# Altium schematic sheet obc-v2_RTC-WDOG.SchDoc
size 420 x 297 mm; SheetNumber: 7; SheetTotal: 23
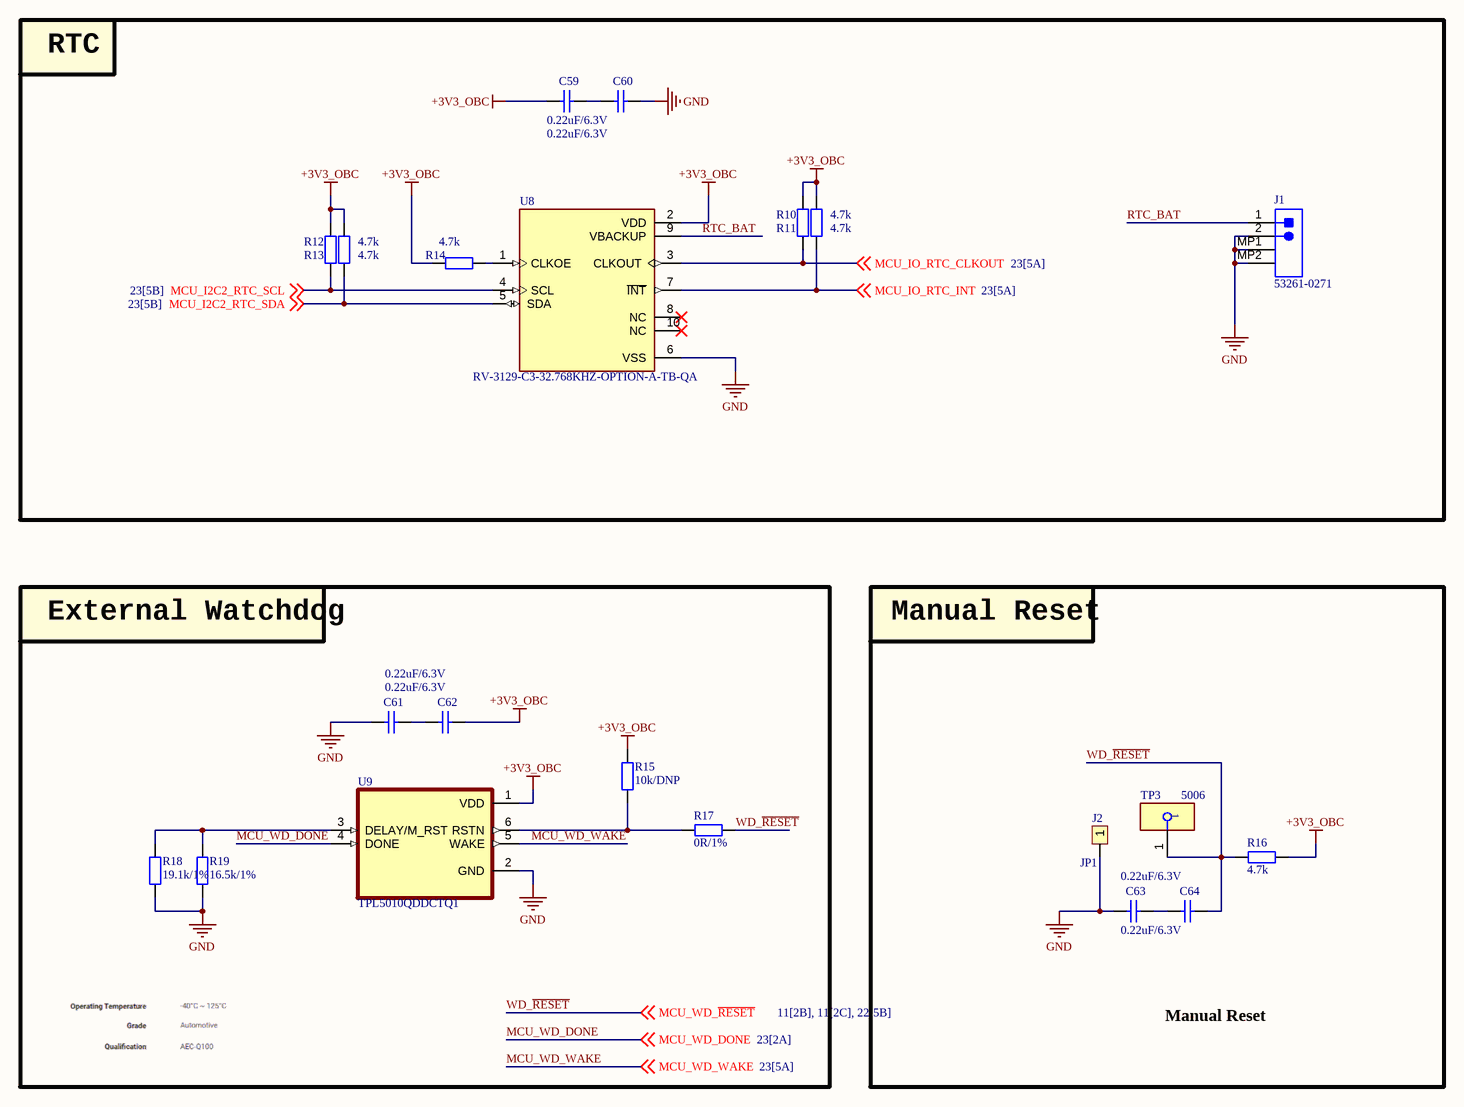
[diagram p0: obc-v2_RTC-WDOG.SchDoc]

## Parts
C59  0.22uF/6.3V  [CAP_C_1005X60]
C60  0.22uF/6.3V  [CAP_C_1005X60]
C61  0.22uF/6.3V  [CAP_C_1005X60]
C62  0.22uF/6.3V  [CAP_C_1005X60]
C63  0.22uF/6.3V  [CAP_C_1005X60]
C64  0.22uF/6.3V  [CAP_C_1005X60]
J1  53261-0271  [MOLX-53261-0271_V]
J2  JP1  [JP1-D1T]
R10  4.7k  [RES_C_1608X60]
R11  4.7k  [RES_C_1608X60]
R12  4.7k  [RES_C_1608X60]
R13  4.7k  [RES_C_1608X60]
R14  4.7k  [RES_C_1608X60]
R15  10k/DNP  [RES_C_1608X60]
R16  4.7k  [RES_C_1608X60]
R17  0R/1%  [RES_C_1608X60]
R18  19.1k/1%  [RES_C_1608X60]
R19  16.5k/1%  [RES_C_1608X60]
TP3  5006  [FP-5006-MFG]
U8  RV-3129-C3-32.768KHZ-OPTION-A-TB-QA  [IC_RV-3129-C3_32.768KHZ_OPTION_A_TB_QA]
U9  TPL5010QDDCTQ1  [SOT95P280X110-6N]

## Blocks framed on the sheet
RTC: C59 C60 J1 R10-R14 U8
External Watchdog: C61 C62 R15 R17-R19 U9
Manual Reset: C63 C64 J2 R16 TP3

## Nets
+3V3_OBC: C59.2 C62.1 R10.2 R11.2 R12.2 R13.2 R14.2 R15.2 R16.2 U8.2(VDD) U9.1(VDD)
GND: C60.1 C61.2 C63.2 J1.2 J1.MP1 J1.MP2 J2.1 R18.1 R19.1 U8.6(VSS) U9.2(GND)
MCU_I2C2_RTC_SCL: R13.1 U8.4(SCL) ; off-sheet MCU_I2C2_RTC_SCL
MCU_I2C2_RTC_SDA: R12.1 U8.5(SDA) ; off-sheet MCU_I2C2_RTC_SDA
MCU_IO_RTC_CLKOUT: R11.1 U8.3(CLKOUT) ; off-sheet MCU_IO_RTC_CLKOUT
MCU_IO_RTC_INT: R10.1 U8.7(~{INT}) ; off-sheet MCU_IO_RTC_INT
MCU_WD_DONE: U9.4(DONE) ; off-sheet MCU_WD_DONE
MCU_WD_WAKE: U9.5(WAKE) ; off-sheet MCU_WD_WAKE
RTC_BAT: J1.1 U8.9(VBACKUP)
WD_~{RESET}: C64.1 R16.1 R17.1 TP3.1 ; off-sheet MCU_WD_~{RESET}  [also labelled MCU_WD_~{RESET}]
NetC59_1: C59.1 C60.2
NetC61_1: C61.1 C62.2
NetC63_1: C63.1 C64.2
NetR14_1: R14.1 U8.1(CLKOE)
NetR15_1: R15.1 R17.2 U9.6(RSTN)
NetR18_2: R18.2 R19.2 U9.3(DELAY/M_RST)

Not connected (* = marked no-connect by the designer): U8 8(NC)* 10(NC)*

## Notes on the sheet
- Manual Reset
- Project:
- Sub-system:
- Design by:
- Sheet title:
- Sheet
- A3
- of
- Checked by:
- Approved by:
- Revision:
- Document No:
- Size:
- Date:

## Library data of the parts
C59-C64 = Tu 0402 33nF 10V: CAPC; Chung_Loai: Dán; Don_Vi: Con; So_Chan: 2; Ten_Linh_Kien: Tụ 0402 33nF X7R 10V GRM155R71A333KA01D; Ma_Hang: MH007853; Kieu_Chan: *
J1 = CMP-2000-05633-1: PicoBlade(TM) Header, Right Angle, -40 to 85 degC, 2-Pin SMD, RoHS, Tape and Reel; Current - Max: 1A; Brand: Molex; Voltage Rating: 125V; Number of Positions: 2; Pitch: 1.25mm; Package Version: Rev. H, 11/2014; Factory Pack Quantity: 1000; Datasheet URL: http://www.molex.com/webdocs/datasheets/pdf/en-us/0532610271_PCB_HEADERS.pdf; Datasheet Version: 03/2016; Housing Material: Thermoplastic; RoHS: Details; Product Type: Headers; Number of Rows: 1; Termination Style: SMD; Mounting Technology: SurfaceMount; Number of Positions / Contacts: 2; Package URL: http://www.molex.com/pdm_docs/sd/532610271_sd.pdf; Mounting Angle: Right; Mounting Style: SMD/SMT; Manufacturer: Molex; Product Category: 1.25mmConnectors; Tradename: PicoBlade; Voltage - Max: 125V; Manufacturer URL: http://www.molex.com/; Series: 53261; Package Description: 2-Leads Header, Pitch 1.25 mm, Mated Height 3.4 mm; Package Reference: 53261-0271; Current Rating: 1A; Contact Plating: Tin; Contact Material: PhosphorBronze; Type: Shrouded; Packaging: Reel
J2 = JP1: WR-PHD 2.54 mm Angled Socket Header; Manufacturer: W¨¹rth Elektronik eiSos GmbH; partNo: 613002143121; ComponentLink1 Description: Manufacturer; ComponentLink2 Description: Datasheet; NoPins: 02; Created Date: 29 March 2013; ComponentLink1URL: http://www.we-online.com; ComponentLink2URL: http://katalog.we-online.de/em/datasheet/6130xx143121.pdf; Created by: Karrer Zheng
R10-R14 R16 R17 = Tro 0603 1% 10k: RES; Chung_Loai: Dán; Don_Vi: Con; So_Chan: 2; Ten_Linh_Kien: Trở 0603 1% 10k; Ma_Hang: MH006333; Kieu_Chan: *
R15 = Tro 0603 1% 10k: RES SMD 10K OHM 1% 1/10W 0603, P/N: ERJ-3EKF1002V; Chung_Loai: Dán; Don_Vi: Con; So_Chan: 2; Ten_Linh_Kien: Trở 0603 1% 10k; Ma_Hang: MH006333; Kieu_Chan: *
R18 = Tro 0603 1% 10k: RES SMD 19.1K OHM 1% 1/10W 0603, P/N: ERJ-3EKF1912V; Chung_Loai: Dán; Don_Vi: Con; So_Chan: 2; Ten_Linh_Kien: Trở 0603 1% 10k; Ma_Hang: MH006333; Kieu_Chan: *
R19 = Tro 0603 1% 10k: RES SMD 16.5K OHM 1% 1/10W 0603, P/N: ERJ-3EKF1652V; Chung_Loai: Dán; Don_Vi: Con; So_Chan: 2; Ten_Linh_Kien: Trở 0603 1% 10k; Ma_Hang: MH006333; Kieu_Chan: *
TP3 = CMP-19636-000022-1: PC TEST POINT COMPACT BLACK; Body Material: Bronze; Inside Diameter: 1.78mm; Number of Ports: 1; Hole Diameter: 1.6mm; Outside Diameter: 3.18mm; Plating: Silver; Contact Plating: Tin; Color: Black; RoHS Compliant: Yes; Flammability Rating: UL94 V-0; Contact Material: Bronze; Material: Nylon; Orientation: Straight; Package Quantity: 100; Housing Color: Black; Length: 8.89mm; Series: THM; Mount: PCB; Height: 0.35inch; Packaging: Bulk; REACH SVHC: No SVHC; Insulation Material: Nylon; Lead Free: Lead Free
U8 = RV-3129-C3_32.768KHZ_OPTION_A_TB_QA: Real-Time Clock Module, Temperature compensated, in 2.5 x 3.7 mm package; MF: Micro Crystal; MP: RV-3129-C3 32.768KHZ OPTION A TB QA; SnapEDA_Link: https://www.snapeda.com/parts/RV-3129-C3%2032.768KHZ%20OPTION%20A%20TB%20QA/Micro+Crystal/view-part/?ref=snap; Package: QFN-10 Micro Crystal; Value: *; Check_prices: https://www.snapeda.com/parts/RV-3129-C3%2032.768KHZ%20OPTION%20A%20TB%20QA/Micro+Crystal/view-part/?ref=eda
U9 = TPL5010QDDCTQ1: Package: None; Price: None; Value: *; MP: TPL5010QDDCTQ1; Availability: Unavailable